# Altium schematic sheet SDP21_Main_Board_Schematic.SchDoc
size A4
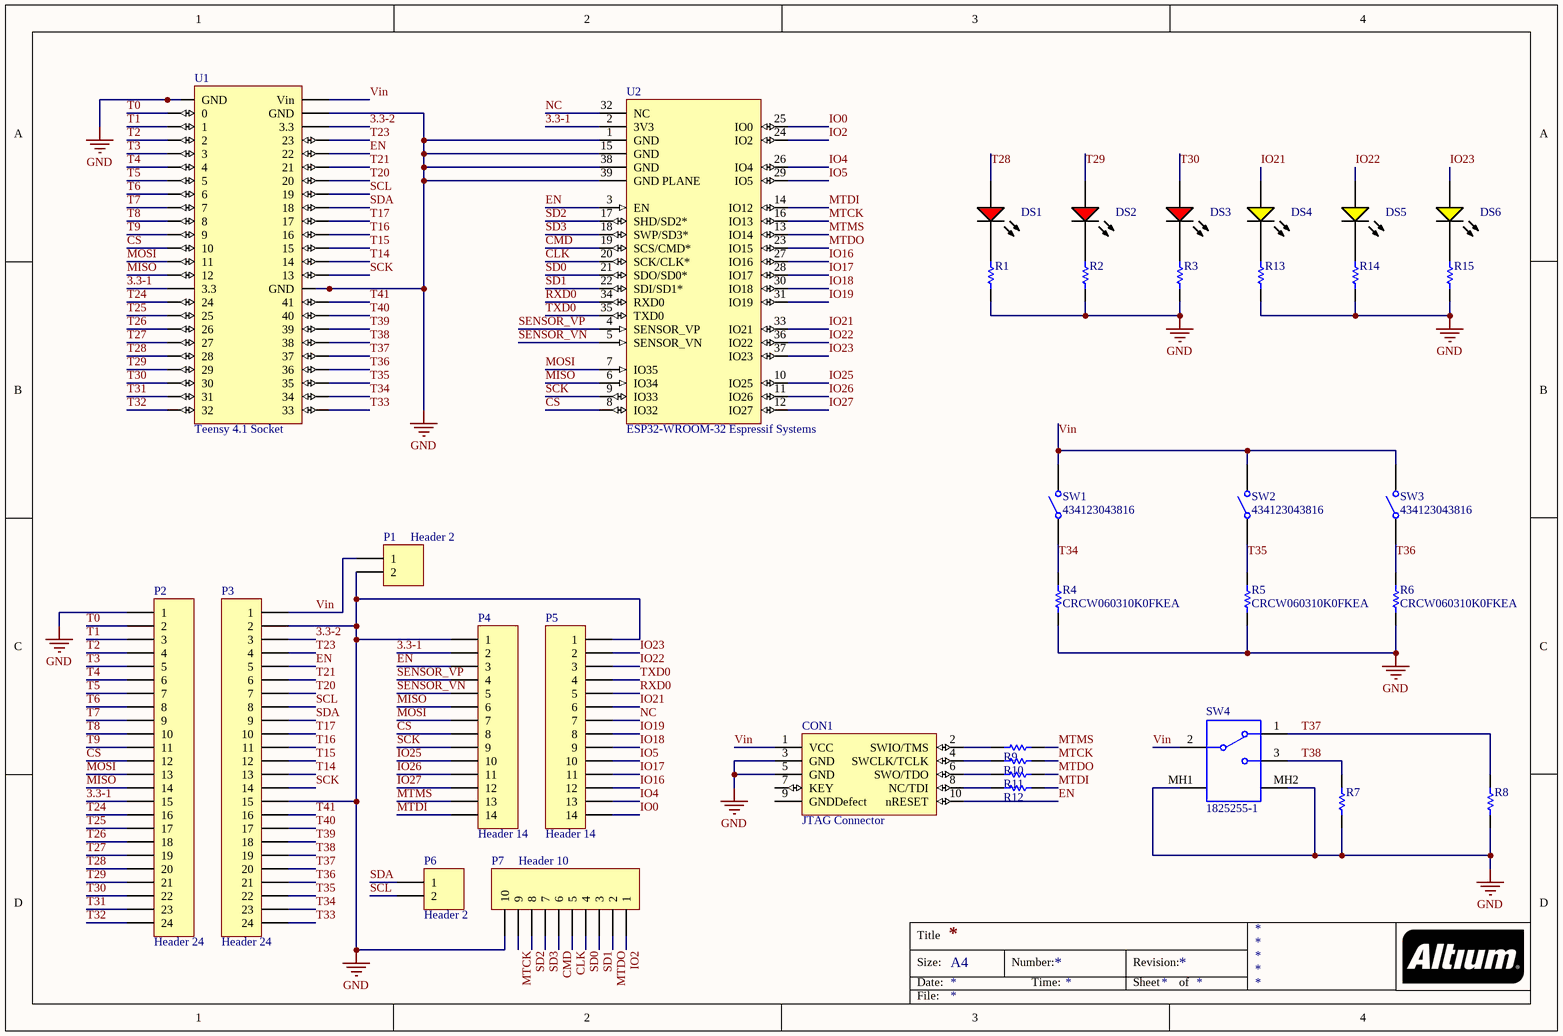
[diagram p0: SDP21_Main_Board_Schematic.SchDoc]

## Parts
CON1  JTAG Connector  [5x2 - 50mil]
DS1  TLMS1000-GS08  [VISH-TLMS1000_V]  (value not drawn)
DS2  TLMS1000-GS08  [VISH-TLMS1000_V]  (value not drawn)
DS3  TLMS1000-GS08  [VISH-TLMS1000_V]  (value not drawn)
DS4  TLMY1000-GS08  [VISH-TLMY1000_V]  (value not drawn)
DS5  TLMY1000-GS08  [VISH-TLMY1000_V]  (value not drawn)
DS6  TLMY1000-GS08  [VISH-TLMY1000_V]  (value not drawn)
P1  Header 2  [HDR1X2]
P2  Header 24  [HDR1X24]
P3  Header 24  [HDR1X24]
P4  Header 14  [HDR1X14]
P5  Header 14  [HDR1X14]
P6  Header 2  [HDR1X2]
P7  Header 10  [HDR1X10]
R1  RR1220P-331-D  [RESC2013X50X40LL20T20]  (value not drawn)
R2  RR1220P-331-D  [RESC2013X50X40LL20T20]  (value not drawn)
R3  RR1220P-331-D  [RESC2013X50X40LL20T20]  (value not drawn)
R4  CRCW060310K0FKEA  [RESC1609X50X30NL8T20]
R5  CRCW060310K0FKEA  [RESC1609X50X30NL8T20]
R6  CRCW060310K0FKEA  [RESC1609X50X30NL8T20]
R7  CRCW060310K0FKEA  [RESC1609X50X30NL8T20]  (value not drawn)
R8  CRCW060310K0FKEA  [RESC1609X50X30NL8T20]  (value not drawn)
R9  CRCW0603100RFKEA  [RESC1609X50X30NL10T20]  (value not drawn)
R10  CRCW0603100RFKEA  [RESC1609X50X30NL10T20]  (value not drawn)
R11  CRCW0603100RFKEA  [RESC1609X50X30NL10T20]  (value not drawn)
R12  CRCW0603100RFKEA  [RESC1609X50X30NL10T20]  (value not drawn)
R13  RR1220P-331-D  [RESC2013X50X40LL20T20]  (value not drawn)
R14  RR1220P-331-D  [RESC2013X50X40LL20T20]  (value not drawn)
R15  RR1220P-331-D  [RESC2013X50X40LL20T20]  (value not drawn)
SW1  434123043816  [434123043816]
SW2  434123043816  [434123043816]
SW3  434123043816  [434123043816]
SW4  1825255-1  [TECO-1825255-1_V]
U1  Teensy 4.1 Socket  [Teensy 4.1 Socket]
U2  ESP32-WROOM-32 Espressif Systems  [Espressif ESP32 Castellated]

## Nets
GND: CON1.3(GND) CON1.5(GND) P1.2 P2.1 P3.2 P3.15 P4.1 P5.1 P7.10 R1.1 R2.1 R3.1 R4.1 R5.1 R6.1 R7.1 R8.1 R13.1 R14.1 R15.1 SW4.MH1 SW4.MH2 U1.GND1(GND) U1.GND2(GND) U1.GND3(GND) U2.1(GND) U2.15(GND) U2.38(GND) U2.39(GND_PLANE)
3.3-1: P2.15 P4.2 U1.3.3-1(3.3) U2.2(3V3)
3.3-2: P3.3 U1.3.3-2(3.3)
CLK: P7.5 U2.20(SCK/CLK*)
CMD: P7.6 U2.19(SCS/CMD*)
CS: P2.12 P4.8 U1.10 U2.8(IO32)
EN: CON1.10(nRESET) P3.5 P4.3 U1.22 U2.3(EN)
IO0: P5.14 U2.25(IO0)
IO2: P7.1 U2.24(IO2)
IO4: P5.13 U2.26(IO4)
IO5: P5.10 U2.29(IO5)
IO16: P5.12 U2.27(IO16)
IO17: P5.11 U2.28(IO17)
IO18: P5.9 U2.30(IO18)
IO19: P5.8 U2.31(IO19)
IO21: DS4.1(A) P5.6 U2.33(IO21)
IO22: DS5.1(A) P5.3 U2.36(IO22)
IO23: DS6.1(A) P5.2 U2.37(IO23)
IO25: P4.10 U2.10(IO25)
IO26: P4.11 U2.11(IO26)
IO27: P4.12 U2.12(IO27)
MISO: P2.14 P4.6 U1.12 U2.6(IO34)
MOSI: P2.13 P4.7 U1.11 U2.7(IO35)
MTCK: P7.9 R10.2 U2.16(IO13)
MTDI: P4.14 R12.2 U2.14(IO12)
MTDO: P7.2 R11.2 U2.23(IO15)
MTMS: P4.13 R9.2 U2.13(IO14)
NC: P5.7 U2.32(NC)
RXD0: P5.5 U2.34(RXD0)
SCK: P3.14 P4.9 U1.13 U2.9(IO33)
SCL: P3.8 P6.2 U1.19
SD0: P7.4 U2.21(SDO/SD0*)
SD1: P7.3 U2.22(SDI/SD1*)
SD2: P7.8 U2.17(SHD/SD2*)
SD3: P7.7 U2.18(SWP/SD3*)
SDA: P3.9 P6.1 U1.18
SENSOR_VN: P4.5 U2.5(SENSOR_VN)
SENSOR_VP: P4.4 U2.4(SENSOR_VP)
T0: P2.2 U1.0
T1: P2.3 U1.1
T2: P2.4 U1.2
T3: P2.5 U1.3
T4: P2.6 U1.4
T5: P2.7 U1.5
T6: P2.8 U1.6
T7: P2.9 U1.7
T8: P2.10 U1.8
T9: P2.11 U1.9
T14: P3.13 U1.14
T15: P3.12 U1.15
T16: P3.11 U1.16
T17: P3.10 U1.17
T20: P3.7 U1.20
T21: P3.6 U1.21
T23: P3.4 U1.23
T24: P2.16 U1.24
T25: P2.17 U1.25
T26: P2.18 U1.26
T27: P2.19 U1.27
T28: DS1.1(A) P2.20 U1.28
T29: DS2.1(A) P2.21 U1.29
T30: DS3.1(A) P2.22 U1.30
T31: P2.23 U1.31
T32: P2.24 U1.32
T33: P3.24 U1.33
T34: P3.23 R4.2 SW1.1 U1.34
T35: P3.22 R5.2 SW2.1 U1.35
T36: P3.21 R6.2 SW3.1 U1.36
T37: P3.20 R8.2 SW4.1 U1.37
T38: P3.19 R7.2 SW4.3 U1.38
T39: P3.18 U1.39
T40: P3.17 U1.40
T41: P3.16 U1.41
TXD0: P5.4 U2.35(TXD0)
Vin: CON1.1(VCC) P1.1 P3.1 SW1.2 SW2.2 SW3.2 SW4.2 U1.Vin
NetCON1_2: CON1.2(SWIO/TMS) R9.1
NetCON1_4: CON1.4(SWCLK/TCLK) R10.1
NetCON1_6: CON1.6(SWO/TDO) R11.1
NetCON1_8: CON1.8(NC/TDI) R12.1
NetDS1_2: DS1.2(K) R1.2
NetDS2_2: DS2.2(K) R2.2
NetDS3_2: DS3.2(K) R3.2
NetDS4_2: DS4.2(K) R13.2
NetDS5_2: DS5.2(K) R14.2
NetDS6_2: DS6.2(K) R15.2

Not connected (* = marked no-connect by the designer): CON1 7(KEY) 9(GNDDefect)

## Notes on the sheet
- Title
- Size:
- Date:
- A4
- Number:
- Time:
- Revision:
- Sheet
- of
- File:

## Library data of the parts
DS1-DS3 = CMP-2000-07254-1: Low Current LED, 40 mW, 1.8 V, -40 to 100 degC, 2-Pin SMD (0603), RoHS, Tape and Reel; Manufacturer: Vishay; Lens Shape: Rectangular; Automotive Qualification Standard: AEC-Q100; Wavelength Typ: 636nm; SVHC: ToBeAdvised; LED Colour: Red; Bulb Size: 1.6mmx0.8mm; Forward Voltage: 1.8V; Luminous Intensity: 4mcd; Forward Current If: 2mA; Viewing Angle: 80°; Datasheet Version: Rev. 1.7, 02/2011; Datasheet URL: https://datasheet.ciiva.com/5798/1698881-5798337.pdf; LED Mounting: SMD; Packaging: CutTape; Package Reference: TLMS1000; Manufacturer URL: http://www.vishay.com/; Mounting Technology: SurfaceMount; Product Range: -; Package Description: 2-Pin Surface Mount Device, Body 1.6 x 0.8 mm; MSL: MSL2-1year
DS4-DS6 = CMP-2000-07255-1: Low Current LED, 40 mW, -40 to 100 degC, 2-Pin SMD, RoHS, Tape and Reel; Manufacturer: Vishay; Wavelength Typ: 595nm; Forward Current If: 2mA; Viewing Angle: 80°; Bulb Size: 1.6mmx0.8mm; Forward Voltage: 1.8V; Luminous Intensity: 7.5mcd; SVHC: ToBeAdvised; Automotive Qualification Standard: AEC-Q100; LED Colour: Yellow; Lens Shape: Rectangular; LED Mounting: SMD; Mounting Technology: SurfaceMount; Packaging: CutTape; MSL: MSL2-1year; Datasheet URL: http://www.vishay.com/docs/83172/tlmo1000.pdf; Package Reference: TLMY1000; Manufacturer URL: http://www.vishay.com/; Package Description: 2-Pin Surface Mount Device, Body 1.6 x 0.8 mm; Datasheet Version: Rev. 2.0, 09/2013; Product Range: -
P1 P6 = Header 2: Header, 2-Pin; LatestRevisionDate: 17-Jul-2002; LatestRevisionNote: Re-released for DXP Platform.; Publisher: Altium Limited
P2 P3 = Header 24: Header, 24-Pin; LatestRevisionDate: 17-Jul-2002; LatestRevisionNote: Re-released for DXP Platform.; Publisher: Altium Limited
P4 P5 = Header 14: Header, 14-Pin; LatestRevisionDate: 17-Jul-2002; LatestRevisionNote: Re-released for DXP Platform.; Publisher: Altium Limited
P7 = Header 10: Header, 10-Pin; LatestRevisionDate: 17-Jul-2002; LatestRevisionNote: Re-released for DXP Platform.; Publisher: Altium Limited
R1-R3 R13-R15 = CMP-2001-03378-1: Manufacturer: Susumu; Part Number: RR1220P-331-D
R4-R8 = CMP-1666-00005-4: Chip Resistor, 10 KOhm, +/- 1%, 100 mW, -55 to 155 degC, 0603 (1608 Metric), RoHS, Tape and Reel; Manufacturer: Vishay Semiconductor; Voltage Rating: 75 V; Max Operating Temperature: 155 degC; PackageDescription: 2-Pin Surface Mount Device, Body 1.575 x 0.85 mm; ComponentLink1Description: Manufacturer URL; RoHSCompliant: true; PackageReference: 0603; REACH SVHC: Unknown; Length: 1.55 mm; DatasheetVersion: 06/2012; Packaging: Tape and Reel; Min Operating Temperature: -55 degC; Mounting Technology: Surface Mount; ComponentLink2URL: https://datasheet.ciiva.com/11809/0900766b80d98afc-11809037.pdf; Height: 0.45 mm; ComponentLink2Description: Datasheet; Package Quantity: 5000; ComponentLink1URL: http://www.vishay.com/
R9-R12 = CMP-2000-03824-1: Manufacturer: Vishay Dale; Part Number: CRCW0603100RFKEA
SW1-SW3 = CMP-1460-00005-1: WS-TASV J-Bend SMD Tact Switch 6.0X3.5 mm; Manufacturer: Wuerth Elektronik; NoPins: 02; ComponentLink1URL: http://www.we-online.com; ComponentLink2Description: Datasheet; PackageReference: 434123043816; ComponentLink1Description: Manufacturer URL; ComponentLink2URL: http://katalog.we-online.de/em/datasheet/434123043816.pdf; PartNumber: 434123043816
SW4 = CMP-2100-03576-1: Slide Switch, SPDT, 125 V, -20 to 85 degC, 5-Pin THD, RoHS, Tray; Manufacturer: TE Connectivity; Electrical Life: 15000Cycles; Number of Positions: 2; Operating Force: 600gf; Max Voltage Rating (AC): 125V; Actuator Length: 4.5mm; Current Rating: 300mA; Contact Style: Shorting; Switch Travel: 4mm; Flammability Rating: UL94HB; Termination: PCPins; Package Quantity: 560; Throw Configuration: SPDT; Datasheet Version: Rev. A4, 03/2014; Mount: ThroughHole; Package Reference: 1825255-1; Case/Package: 300; Depth: 6.7mm; Packaging: Bulk; Package Description: 5-Pin Through Hole Device, Body 6.7 x 16 mm, Pitch 4 mm; REACH SVHC: Unknown; ELV: Compliant; Voltage Rating (AC): 125V; Max Current Rating: 300mA; Radiation Hardening: No; Min Operating Temperature: -20degC; Contact Plating: Silver; Length: 16mm; Manufacturer URL: http://www.te.com/; Orientation: Vertical; Contact Material: Copper; RoHSCompliant: true; Lead Free: LeadFree; Max Operating Temperature: 85degC; Datasheet URL: http://www.te.com/commerce/DocumentDelivery/DDEController?Action=showdoc&DocId=Customer+Drawing%7F1825255%7FA4%7Fpdf%7FEnglish%7FENG_CD_1825255_A4_baseFilename.pdf%7F1825255-1
U1 = Teensy 4.1 Socket: Teensy 4.1
U2 = ESP32-WROOM-32 Espressif Systems: ESP32 BGA mounted on PCB w/ castellated holes